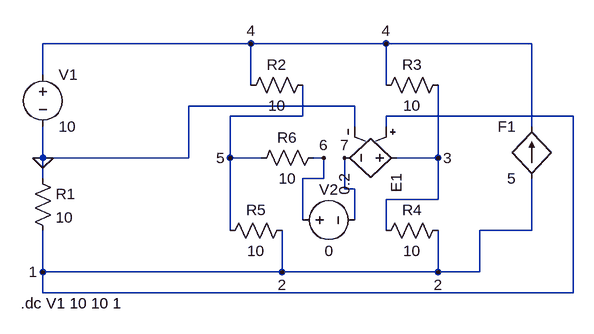
[diagram p0: schematic DC.asc]
DC.asc, the LTspice schematic file:
Version 4
SHEET 1 880 680
WIRE 320 32 0 32
WIRE 528 32 320 32
WIRE 752 32 528 32
WIRE 0 80 0 32
WIRE 320 96 320 32
WIRE 528 96 528 32
WIRE 480 128 224 128
WIRE 400 144 400 96
WIRE 400 144 288 144
WIRE 816 144 528 144
WIRE 480 160 480 128
WIRE 528 160 528 144
WIRE 752 160 752 32
WIRE 0 208 0 160
WIRE 224 208 224 128
WIRE 224 208 0 208
WIRE 288 208 288 144
WIRE 336 208 288 208
WIRE 432 208 416 208
WIRE 608 208 608 96
WIRE 608 208 544 208
WIRE 0 240 0 208
WIRE 432 240 432 208
WIRE 432 240 400 240
WIRE 464 256 464 208
WIRE 480 256 464 256
WIRE 608 272 608 208
WIRE 608 272 528 272
WIRE 400 304 400 240
WIRE 480 304 480 256
WIRE 288 320 288 208
WIRE 528 320 528 272
WIRE 752 320 752 240
WIRE 752 320 672 320
WIRE 0 384 0 320
WIRE 368 384 368 320
WIRE 368 384 0 384
WIRE 608 384 608 320
WIRE 608 384 368 384
WIRE 672 384 672 320
WIRE 672 384 608 384
WIRE 0 416 0 384
WIRE 816 416 816 144
WIRE 816 416 0 416
FLAG 0 208 0
FLAG 0 384 1
FLAG 368 384 2
FLAG 608 384 2
FLAG 608 208 3
FLAG 528 32 4
FLAG 320 32 4
FLAG 288 208 5
FLAG 432 208 6
FLAG 464 208 7
SYMBOL voltage 0 64 R0
WINDOW 123 0 0 Left 0
WINDOW 39 0 0 Left 0
SYMATTR InstName V1
SYMATTR Value 10
SYMBOL res -16 224 R0
SYMATTR InstName R1
SYMATTR Value 10
SYMBOL res 416 80 R90
WINDOW 0 0 56 VBottom 2
WINDOW 3 32 56 VTop 2
SYMATTR InstName R2
SYMATTR Value 10
SYMBOL res 624 80 R90
WINDOW 0 0 56 VBottom 2
WINDOW 3 32 56 VTop 2
SYMATTR InstName R3
SYMATTR Value 10
SYMBOL res 624 304 R90
WINDOW 0 0 56 VBottom 2
WINDOW 3 32 56 VTop 2
SYMATTR InstName R4
SYMATTR Value 10
SYMBOL res 384 304 R90
WINDOW 0 0 56 VBottom 2
WINDOW 3 32 56 VTop 2
SYMATTR InstName R5
SYMATTR Value 10
SYMBOL res 432 192 R90
WINDOW 0 0 56 VBottom 2
WINDOW 3 32 56 VTop 2
SYMATTR InstName R6
SYMATTR Value 10
SYMBOL e 560 208 R90
SYMATTR InstName E1
SYMATTR Value 0.2
SYMBOL f 752 240 R180
WINDOW 0 24 80 Left 2
WINDOW 3 24 0 Left 2
SYMATTR InstName F1
SYMATTR Value 5
SYMATTR SpiceModel V2
SYMBOL voltage 384 304 R270
WINDOW 0 32 56 VTop 2
WINDOW 3 -32 56 VBottom 2
WINDOW 123 0 0 Left 0
WINDOW 39 0 0 Left 0
SYMATTR InstName V2
SYMATTR Value 0
TEXT -34 432 Left 2 !.dc V1 10 10 1

The netlist it stands for:
* DC.asc
V1 4 0 10
R1 0 2 10
R2 5 4 10
R3 3 4 10
R4 2 3 10
R5 2 5 10
R6 6 5 10
E1 3 7 2 0 0.2
F1 2 4 V2 5
V2 6 7 0
.dc V1 10 10 1
.backanno
.end

* Results of the author's LTspice run, read from the files saved beside the schematic
* DC transfer characteristic:
*   v1 = 10 
*   V(4) = 10 V
*   V(2) = 4 V
*   V(5) = 6.8 V
*   V(3) = 7.2 V
*   V(6) = 6.4 V
*   V(7) = 6.4 V
*   I(F1) = 200 mA
*   I(R6) = -40 mA
*   I(R5) = -280 mA
*   I(R4) = -320 mA
*   I(R3) = -280 mA
*   I(R2) = -320 mA
*   I(R1) = -400 mA
*   I(E1) = -40 mA
*   I(V2) = 40 mA
*   I(V1) = -400 mA